# Altium schematic sheet BEESP_CODE_usb.SchDoc
size A4
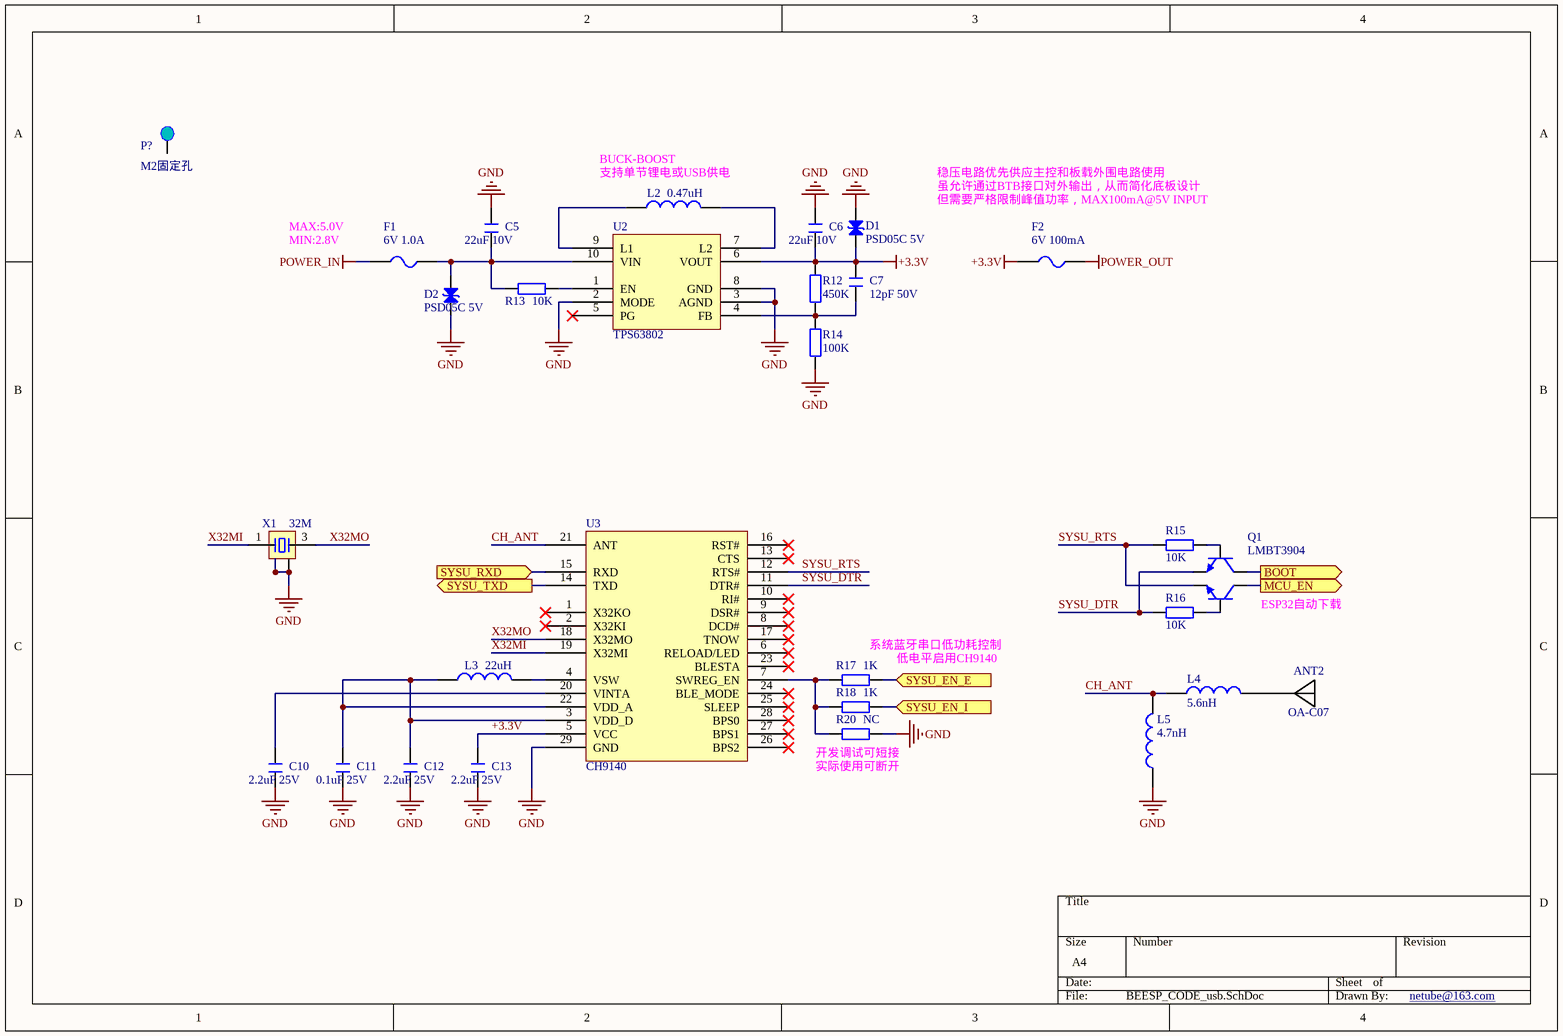
[diagram p0: BEESP_CODE_usb.SchDoc]

## Parts
ANT2  OA-C07
C5  22uF 10V  [C 0603_L]
C6  22uF 10V  [C 0603_L]
C7  12pF 50V  [C 0603_L]
C10  2.2uF 25V  [C 0603_L]
C11  0.1uF 25V  [C 0603_L]
C12  2.2uF 25V  [C 0603_L]
C13  2.2uF 25V  [C 0603_L]
D1  PSD05C 5V  [SOD-323]
D2  PSD05C 5V  [SOD-323]
F1  6V 1.0A  [FU 0603]
F2  6V 100mA  [FU 0603]
L2  0.47uH  [L 0805]
L3  22uH  [L 0603]
L4  5.6nH  [L 0603]
L5  4.7nH  [L 0603]
P?  M2固定孔  [M2]
Q1  LMBT3904  [SOT-363]
R12  450K  [R 0603_L]
R13  10K  [R 0603_L]
R14  100K  [R 0603_L]
R15  10K  [R 0603_L]
R16  10K  [R 0603_L]
R17  1K  [R 0603_L]
R18  1K  [R 0603_L]
R20  NC  [R 0603_L]
U2  TPS63802  [VSON-10_L3.0-W2.0-P0.50-TL]
U3  CH9140  [QFN28 4*4]
X1  32M  [OSC 1612-4P]

## Ports
BOOT (out), MCU_EN (out), SYSU_EN_E (in), SYSU_EN_I (in), SYSU_RXD (in), SYSU_TXD (out)

## Nets
+3.3V: C6.1 C7.2 C13.1 D1.2(K) F2.1 R12.1 U2.6(VOUT) U3.5(VCC)
GND: C5.2 C6.2 C10.2 C11.2 C12.2 C13.2 D1.1(A) D2.1(A) L5.1 R14.1 R20.2 U2.2(MODE) U2.3(AGND) U2.8(GND) U3.29(GND) X1.2 X1.4
POWER_IN: F1.1
POWER_OUT: F2.2
BOOT: Q1.3(C) ; port BOOT
CH_ANT: L4.1 L5.2 U3.21(ANT)
MCU_EN: Q1.6(C) ; port MCU_EN
SYSU_DTR: Q1.4(E) R16.1 U3.11(DTR#)
SYSU_EN_E: R17.2 ; port SYSU_EN_E
SYSU_EN_I: R18.2 ; port SYSU_EN_I
SYSU_RTS: Q1.1(E) R15.1 U3.12(RTS#)
SYSU_RXD: U3.15(RXD) ; port SYSU_RXD
SYSU_TXD: U3.14(TXD) ; port SYSU_TXD
X32MI: U3.19(X32MI) X1.1
X32MO: U3.18(X32MO) X1.3
NetANT2_1: ANT2.1 L4.2
NetC5_1: C5.1 D2.2(K) F1.2 R13.1 U2.10(VIN)
NetC7_1: C7.1 R12.2 R14.2 U2.4(FB)
NetC10_1: C10.1 U3.20(VINTA)
NetC11_1: C11.1 C12.1 L3.1 U3.3(VDD_D) U3.22(VDD_A)
NetL2_1: L2.1 U2.9(L1)
NetL2_2: L2.2 U2.7(L2)
NetL3_2: L3.2 U3.4(VSW)
NetQ1_2: Q1.2(B) R16.2
NetQ1_5: Q1.5(B) R15.2
NetR13_2: R13.2 U2.1(EN)
NetR17_1: R17.1 R18.1 R20.1 U3.7(SWREG_EN)

Not connected (* = marked no-connect by the designer): P? 1; U2 5(PG)*; U3 1(X32KO)* 2(X32KI)* 6(RELOAD/LED)* 8(DCD#)* 9(DSR#)* 10(RI#)* 13(CTS)* 16(RST#)* 17(TNOW)* 23(BLESTA)* 24(BLE_MODE)* 25(SLEEP)* 26(BPS2)* 27(BPS1)* 28(BPS0)*

## Notes on the sheet
- (near L2) BUCK-BOOST
- (near L2) 支持单节锂电或USB供电
- 稳压电路优先供应主控和板载外围电路使用
- MIN:2.8V
- MAX:5.0V
- 虽允许通过BTB接口对外输出，从而简化底板设计
- 但需要严格限制峰值功率，MAX100mA@5V INPUT
- (near R17) 系统蓝牙串口低功耗控制
- (near Q1) ESP32自动下载
- 低电平启用CH9140
- (near R20) 开发调试可短接
- (near R20) 实际使用可断开
- netube@163.com

## Library data of the parts
ANT2 = ANT1: PCB板载天线; 版权归属: 封装库来自淘宝 ID：黄晶宝石; BOM名称: PCB板载天线; 技术支持，联系售后: https://shop463601444.taobao.com
C5-C7 C10-C13 = C: 贴片电容; BOM名称: 无极性贴片电容; 优秀评价可免费更新: 联系淘宝ID：黄晶宝石，获取更新版封装库; 卖家免费技术支持，联系售后: 唯一出售店铺网址https://shop463601444.taobao.com; 本封装库来自淘宝卖家 ID：黄晶宝石: 其他店铺购入均为盗版，请立即申请退款
D1 D2 = TVS: TVS保护; 卖家免费技术支持，联系售后: 唯一出售店铺网址https://shop463601444.taobao.com; 优秀评价可免费更新: 联系淘宝ID：黄晶宝石，获取更新版封装库; 封装库 来自淘宝卖家 ID：黄晶宝石: 其他店铺购入均为盗版，请立即申请退款; Code_JEDEC: DO-214-AB
F1 F2 = FU: 贴片保险丝; 版权归属: 封装库来自淘宝卖家 ID：黄晶宝石; 优秀评价可免费更新: 联系淘宝ID：黄晶宝石，获取更新版封装库; 卖家免费技术支持，联系售后: 唯一出售店铺网址https://shop463601444.taobao.com; 封装库来自淘宝卖家 ID：黄晶宝石: 其他店铺购入均为盗版，请立即申请退款; BOM名称: 贴片保险丝
L2-L5 = L: 小功率贴片电感; 优秀评价可免费更新: 联系淘宝ID：黄晶宝石，获取更新版封装库; 卖家免费技术支持，联系售后: 唯一出售店铺网址https://shop463601444.taobao.com; 本封装库来自淘宝卖家 ID：黄晶宝石: 其他店铺购入均为盗版，请立即申请退款; BOM名称: 小功率贴片电感
P? = M3
Q1 = LMBT3904: LMBT3904DW1T1G; BOM名称: 高频放大-NPN型; 属性: 40V 1.5A 1W 100MHZ; 卖家免费技术支持，联系售后: 唯一出售店铺网址https://shop463601444.taobao.com; 封装库来自淘宝卖家 ID：黄晶宝石: 其他店铺购入均为假冒，请立即申请退款，本店奖励2~5元现金
R12-R18 R20 = R: 贴片电阻; 优秀评价可免费更新: 联系淘宝ID：黄晶宝石，获取更新版封装库; 卖家免费技术支持，联系售后: 唯一出售店铺网址https://shop463601444.taobao.com; 本封装库来自淘宝卖家 ID：黄晶宝石: 其他店铺购入均为盗版，请立即申请退款; BOM名称: 贴片电阻
X1 = XTAL-4P: 4脚无源晶振; 版权归属: 封装库来自淘宝卖家 ID：黄晶宝石; 优秀评价可免费更新: 联系淘宝ID：黄晶宝石，获取更新版封装库; 卖家免费技术支持，联系售后: 唯一出售店铺网址https://shop463601444.taobao.com; 封装库来自淘宝卖家 ID：黄晶宝石: 其他店铺购入均为盗版，请立即申请退款; BOM名称: 4脚无源晶振